# Altium schematic sheet 3V3 Converter (AP63203).schdoc
size 124 x 101 mm
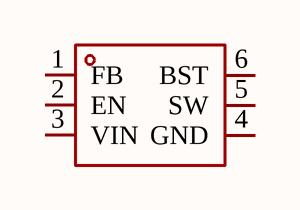
[diagram p0: 3V3 Converter (AP63203).schdoc]

## Parts
U?  AP63203WU-7  [TSOT-26_L2.9-W1.6-P0.95-LS2.8-BL]  (value not drawn)

## Nets

Not connected (* = marked no-connect by the designer): U? 1(FB) 2(EN) 3(VIN) 4(GND) 5(SW) 6(BST)

## Library data of the parts
U? = AP63203WU-7: Manufacturer: DIODES(美台); Add into BOM: yes; Function: Step-down type; Output Type: Fixed; Input Voltage: 3.8V~32V; Output Voltage: 3.3V; Output Current (Max): 2A; Switching Frequency: 1.1MHz; Number of Outputs: 1; Topology: Step-down; Switch tube (built-in/external): 内置; Symbol: AP63203WU-7; Device: AP63203WU-7; LCSC Part Name: AP63203WU-7; Supplier Part: C780769; Manufacturer Part: AP63203WU-7; Supplier Footprint: TSOT-23-6; JLCPCB Part Class: Extended Part; Datasheet: https://atta.szlcsc.com/upload/public/pdf/source/20210622/C780769_099C67289BD3EC61AAFB52D8B07125B3.pdf; Supplier: LCSC; Convert to PCB: yes; Operating Temperature: -40℃~+85℃@(TA); Synchronous Rectification: Yes